# Altium schematic sheet POWER.SchDoc
size A4; SheetNumber: 4; SheetTotal: 4
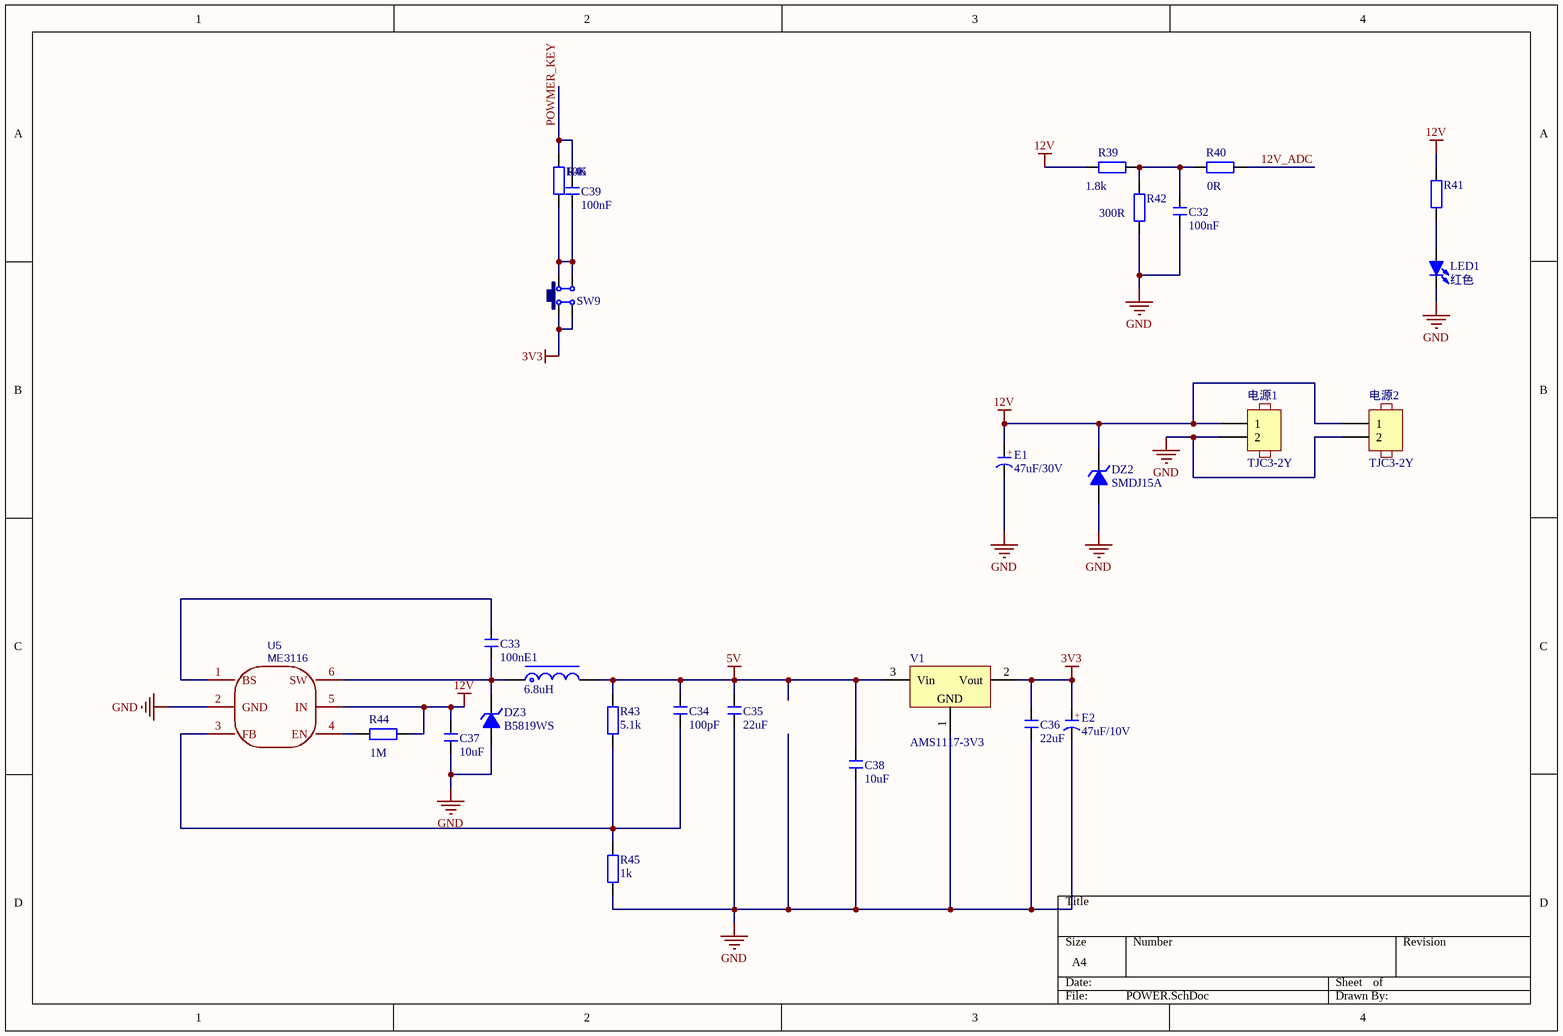
[diagram p0: POWER.SchDoc]

## Parts
C32  100nF  [C 0805_L]
C33  100nF  [C 0805_L]
C34  100pF  [C 0805_L]
C35  22uF  [C 0805_L]
C36  22uF  [C 0805_L]
C37  10uF  [C 0805_L]
C38  10uF  [C 0805_L]
C39  100nF  [C 0603_L]
DZ2  SMDJ15A  [SMC]
DZ3  B5819WS  [SOD-323]
E1  47uF/30V  [CM D(6.3*7.7)]
E2  47uF/10V  [CM B(4*5.4)]
L1  6.8uH  [CD42]
LED1  红色  [LED 0805R]
R39  1.8k  [R 0805_L]
R40  0R  [R 0805_L]
R41  (no value)  [R 0805_L]
R42  300R  [R 0805_L]
R43  5.1k  [R 0805_L]
R44  1M  [R 0805_L]
R45  1k  [R 0805_L]
R46  10K  [R 0603_L]
SW9  6x6x5  [Model Name]  (value not drawn)
U5  ME3116  [SOT23-6]
V1  AMS1117-3V3  [SOT-223]
电源1  TJC3-2Y  [MX 1.25-WS-2P]
电源2  TJC3-2Y  [MX 1.25-WS-2P]

## Nets
3V3: C36.2 E2.1(A) SW9.1 SW9.4 V1.2(Vout)
5V: C34.2 C35.2 C38.2 L1.2 R43.2 V1.3(Vin)
12V: C37.2 DZ2.2(K) E1.1(A) R39.2 R41.1 R44.1 U5.5(IN) 电源1.1 电源2.1
GND: C32.1 C35.1 C36.1 C37.1 C38.1 DZ2.1(A) DZ3.1(A) E1.2(K) E2.2(K) LED1.2(K) R42.2 R45.1 U5.2(GND) V1.1(GND) 电源1.2 电源2.2
12V_ADC: R40.2
POWMER_KEY: C39.2 R46.1
NetC32_2: C32.2 R39.1 R40.1 R42.1
NetC33_1: C33.1 DZ3.2(K) L1.1 U5.6(SW)
NetC33_2: C33.2 U5.1(BS)
NetC34_1: C34.1 R43.1 R45.2 U5.3(FB)
NetC39_1: C39.1 R46.2 SW9.2 SW9.3
NetLED1_1: LED1.1(A) R41.2
NetR44_2: R44.2 U5.4(EN)

## Notes on the sheet
- (in symbol C-CS) +

## Library data of the parts
C32-C39 = C: 无极性贴片电容; 版权归属: 源创客; BOM名称: 无极性贴片电容; 学习资源: www.ooocke.com
DZ2 = 1N4106: TVS 15V截止 峰值浪涌电流：123A                   C438153; BOM名称: 12V/0.5W稳压管; 版权归属: 源创客; 学习资源: www.ooocke.com
DZ3 = 1N5256: 电压:40V 电流:1A                                C7420331; BOM名称: 30V/0.5W稳压管; 版权归属: 源创客; 学习资源: www.ooocke.com
E1 = C-CS: JVJ50V47M6x8                        47uF ±20% 50V                            C46550421; BOM名称: 直插固态电容; 版权归属: 源创客; 学习资源: www.ooocke.com
E2 = C-CS: 47uF ±20% 10V                           C48970978; BOM名称: 直插固态电容; 版权归属: 源创客; 学习资源: www.ooocke.com
L1 = L-CD: YP0402-6R8M                          C576569; BOM名称: 功率电感; 版权归属: 源创客; 学习资源: www.ooocke.com
LED1 = LED-SMD: 贴片LED; 版权归属: 源创客; BOM名称: 贴片LED; 学习资源: www.ooocke.com
R39-R46 = R: 贴片电阻; 版权归属: 源创客; BOM名称: 贴片电阻; 学习资源: www.ooocke.com
SW9 = TSW SMD-6x6: KH-6X6X5H-STM     C2837531; pin to pad: 3>0 4>0; BOM名称: 贴片6x6轻触开关; 版权归属: 源创客; 学习资源: www.ooocke.com
U5 = ME3116: ME3116AM6G / ME3116是一款内部集成了MOSFET的异步整流降压型稳压器,能够在4.75V至40V的输入电压范围内提供高达1A的负载能力。采用PWM控制模式,具有良好的瞬态响应和逐周期限流功能。在轻载条件下自动切换到PFM模式,保证较高的轻载效率。内置软启动和环路补偿,具有过热关断、输入欠压保护、BS欠压保护和短路保护。; Manufacturer: MICRONE(南京微盟); Supplier: LCSC; Manufacturer Part: ME3116AM6G; Supplier Part: C97643; JLCPCB Part Class: Extended Part; spicePre: U; spiceSymbolName: ME3116
V1 = AMS1117: 三端稳压芯片; BOM名称: 稳压芯片; 版权归属: 源创客; 学习资源: www.ooocke.com
电源1 电源2 = TJC3-2Y: Set Position: 0.5; Published: 8-Jun-2000; LatestRevisionDate: 17-Jul-2002; LatestRevisionNote: Re-released for DXP Platform.; PackageReference: AXIAL-0.6; Publisher: Altium Limited